# Altium schematic sheet Com_board_2018.SchDoc
size A4
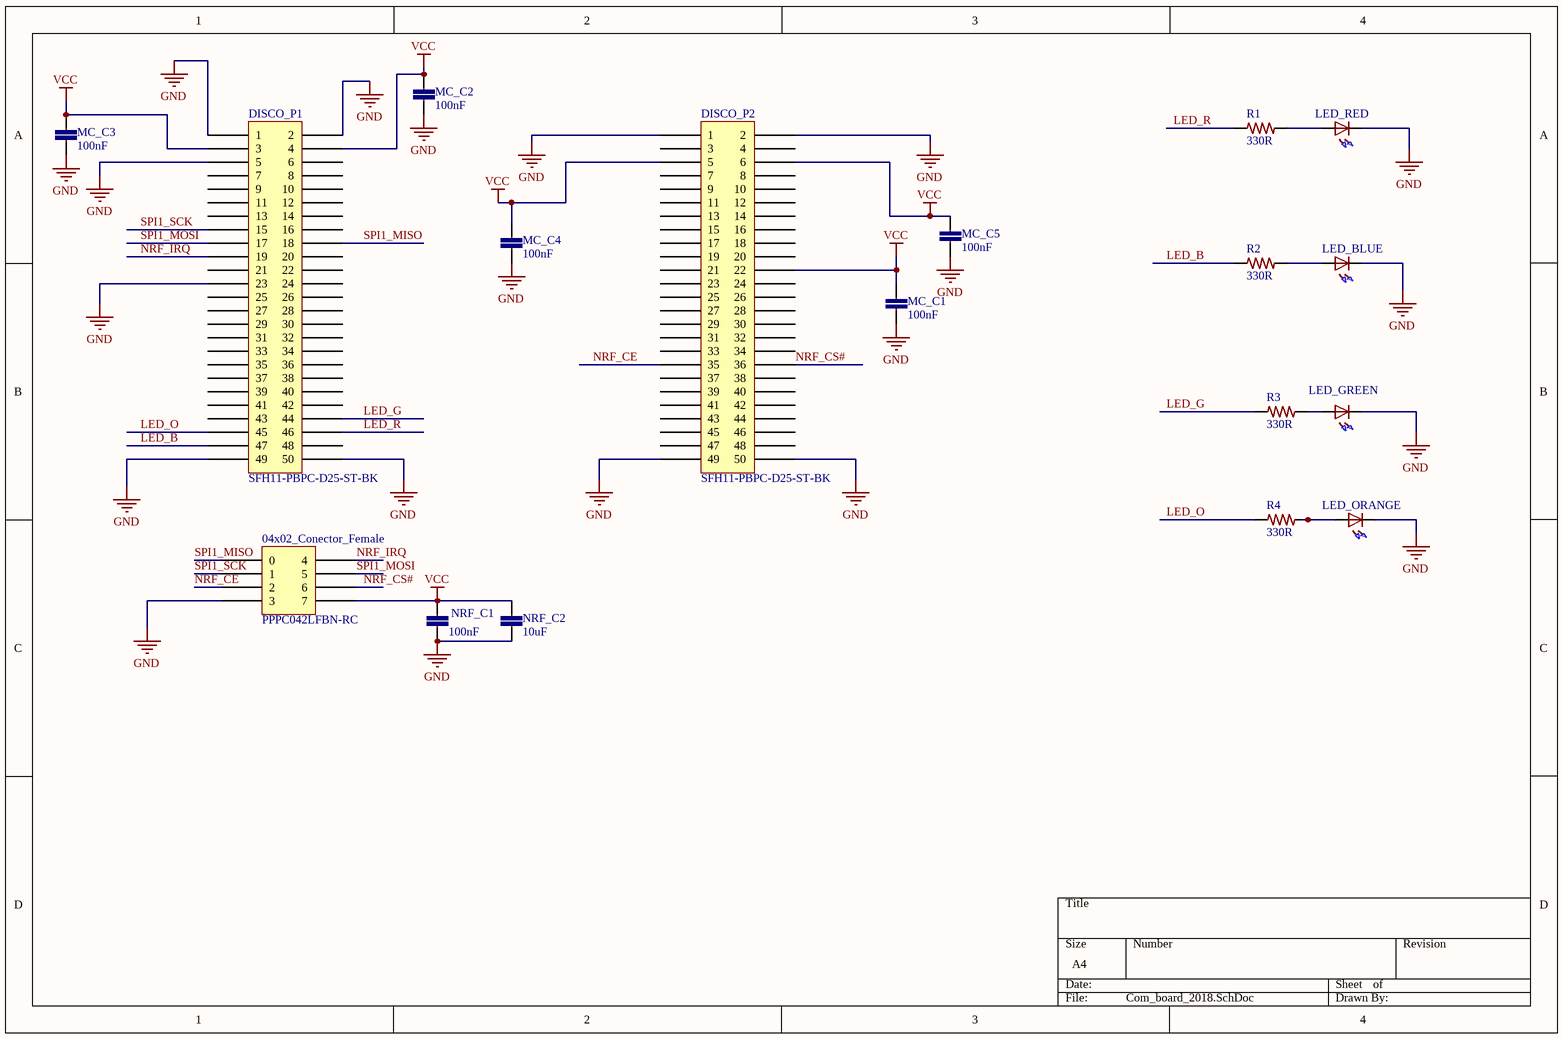
[diagram p0: Com_board_2018.SchDoc]

## Parts
04x02_Conector_Female  PPPC042LFBN-RC  [04x02_Conector_Female]
DISCO_P1  SFH11-PBPC-D25-ST-BK  [25x02_Conector_Female]
DISCO_P2  SFH11-PBPC-D25-ST-BK  [25x02_Conector_Female]
LED_BLUE  LED  [LED-5MM-PCB]  (value not drawn)
LED_GREEN  LED  [LED-5MM-PCB]  (value not drawn)
LED_ORANGE  LED  [LED-5MM-PCB]  (value not drawn)
LED_RED  LED  [LED-5MM-PCB]  (value not drawn)
MC_C1  100nF  [0402-CAP]
MC_C2  100nF  [0402-CAP]
MC_C3  100nF  [0402-CAP]
MC_C4  100nF  [0402-CAP]
MC_C5  100nF  [0402-CAP]
NRF_C1  100nF  [0402-CAP]
NRF_C2  10uF  [0805-CAP]
R1  330R  [0402-RES-HD]
R2  330R  [0402-RES-HD]
R3  330R  [0402-RES-HD]
R4  330R  [0402-RES-HD]

## Nets
GND: 04x02_Conector_Female.3 DISCO_P1.1 DISCO_P1.2 DISCO_P1.5 DISCO_P1.23 DISCO_P1.49 DISCO_P1.50 DISCO_P2.1 DISCO_P2.2 DISCO_P2.49 DISCO_P2.50 LED_BLUE.1(K) LED_GREEN.1(K) LED_ORANGE.1(K) LED_RED.1(K) MC_C1.1 MC_C2.1 MC_C3.2 MC_C4.1 MC_C5.1 NRF_C1.2 NRF_C2.2
VCC: 04x02_Conector_Female.7 DISCO_P1.3 DISCO_P1.4 DISCO_P2.5 DISCO_P2.6 DISCO_P2.22 MC_C1.2 MC_C2.2 MC_C3.1 MC_C4.2 MC_C5.2 NRF_C1.1 NRF_C2.1
LED_B: DISCO_P1.47 R2.1
LED_G: DISCO_P1.44 R3.1
LED_O: DISCO_P1.45 R4.1
LED_R: DISCO_P1.46 R1.1
NRF_CE: 04x02_Conector_Female.2 DISCO_P2.35
NRF_CS#: 04x02_Conector_Female.6 DISCO_P2.36
NRF_IRQ: 04x02_Conector_Female.4 DISCO_P1.19
SPI1_MISO: 04x02_Conector_Female.0 DISCO_P1.18
SPI1_MOSI: 04x02_Conector_Female.5 DISCO_P1.17
SPI1_SCK: 04x02_Conector_Female.1 DISCO_P1.15
NetLED_BLUE_2: LED_BLUE.2(A) R2.2
NetLED_GREEN_2: LED_GREEN.2(A) R3.2
NetLED_ORANGE_2: LED_ORANGE.2(A) R4.2
NetLED_RED_2: LED_RED.2(A) R1.2

Not connected (* = marked no-connect by the designer): DISCO_P1 6 7 8 9 10 11 12 13 14 16 20 21 22 24 25 26 27 28 29 30 31 32 33 34 35 36 37 38 39 40 41 42 43 48; DISCO_P2 3 4 7 8 9 10 11 12 13 14 15 16 17 18 19 20 21 23 24 25 26 27 28 29 30 31 32 33 34 37 38 39 40 41 42 43 44 45 46 47 48

## Library data of the parts
04x02_Conector_Female = 04x02_Conector_Female: 8 Position Header Connector 0.100" (2.54mm) Through Hole Gold
DISCO_P1 DISCO_P2 = 25x02_Conector_Female: 50 Position Header Connector 0.100" (2.54mm) Through Hole Gold
LED_BLUE LED_GREEN LED_ORANGE LED_RED = LED-5MM-3: LED 5MM PTH
MC_C1-MC_C5 NRF_C1 = CC0402-100nF-A.12: CAP CER 0.1UF 10V 20% X5R 0402; Part No: VJ0402V104ZXQPBC; Cod EMS: 05.281.006.133; Value: 100n
NRF_C2 = CC0806-10uF-25V-1: CAP CER 10UF 25V X5R 0805; Part No: GRM21BR61E106KA73L; Cod EMS: 05.281.019.590; Value: 10uF
R1-R4 = R0402-330R-7: RES 330 OHM 1/10W 1% 0402 SMD; Part No: ERJ-2RKF3300X; Cod EMS: 05.280.029.506; Value: 330; Family Description: RESISTOR FILME ESPESSO 10R-1M / 1/10W / 1% / 0402. P/N: ERJ-2RKF....X – PANASONIC ELECTRONIC COMPONENTS.; Family: ERJ-2RKF....X